# EAGLE board msi0010_new (EAGLE 6.1), part 1 of 2
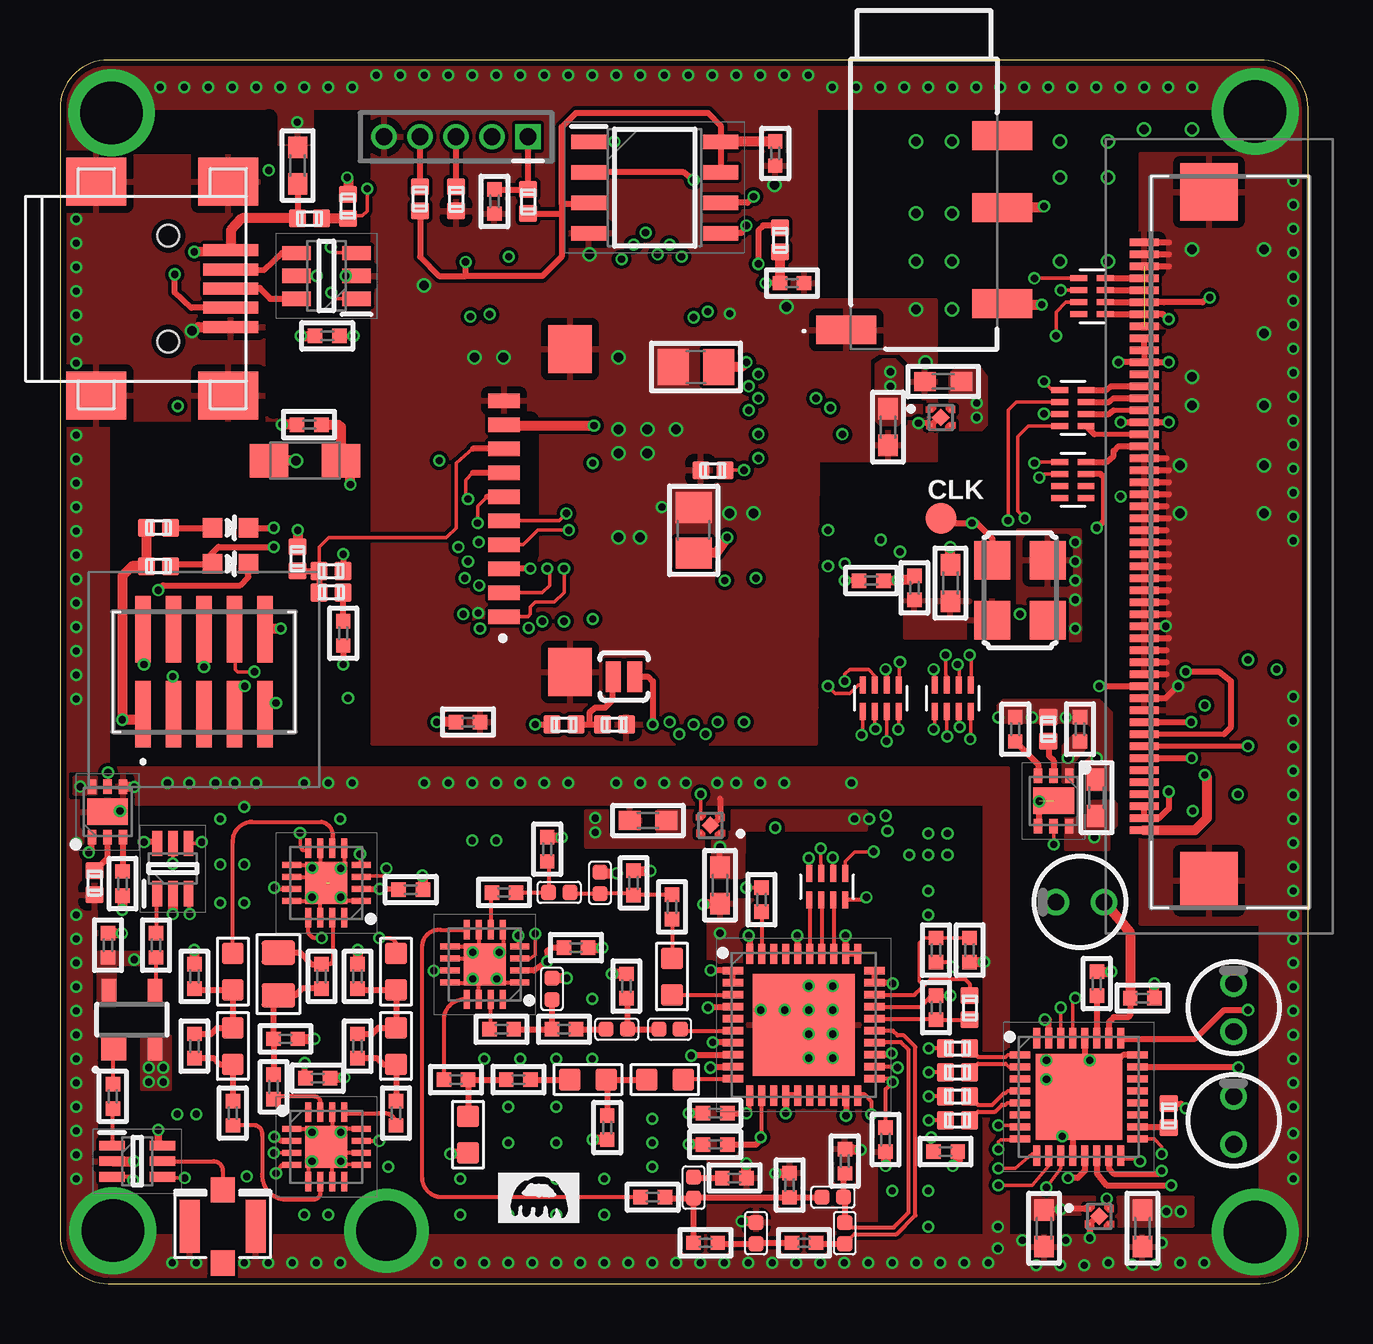
[diagram p3: board, top side]
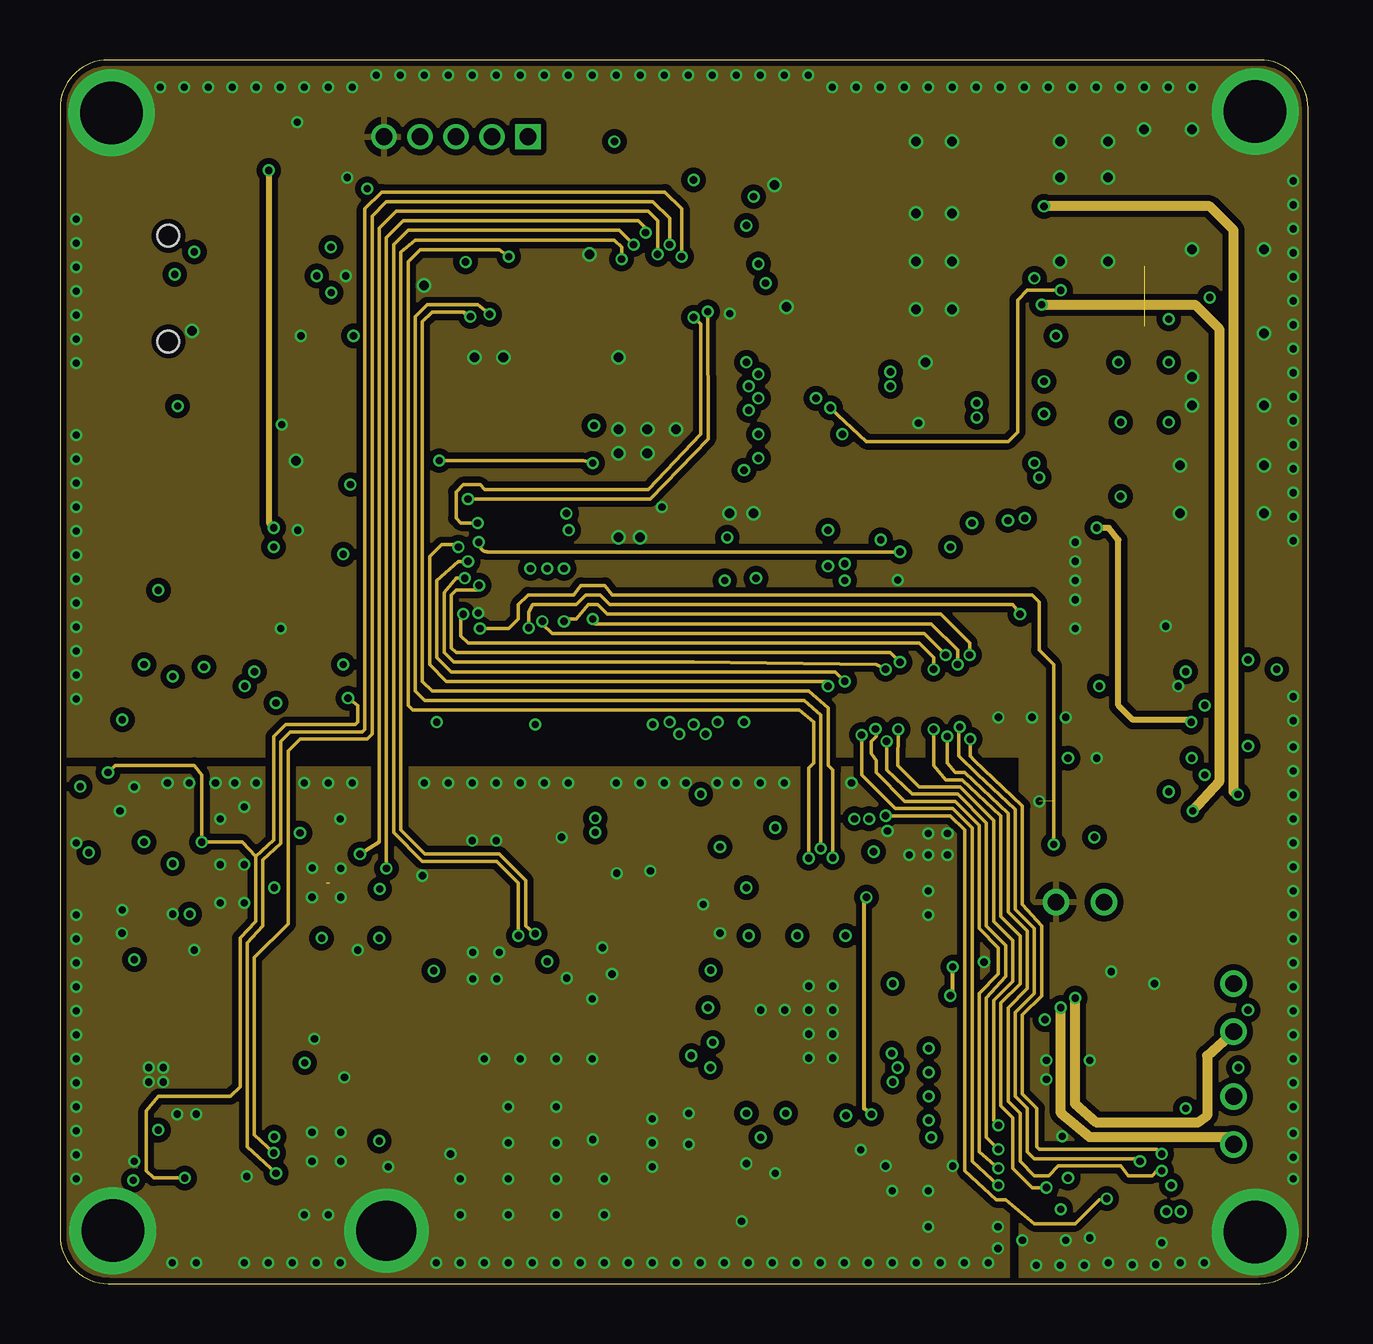
[diagram p4: board, inner layer Route2]
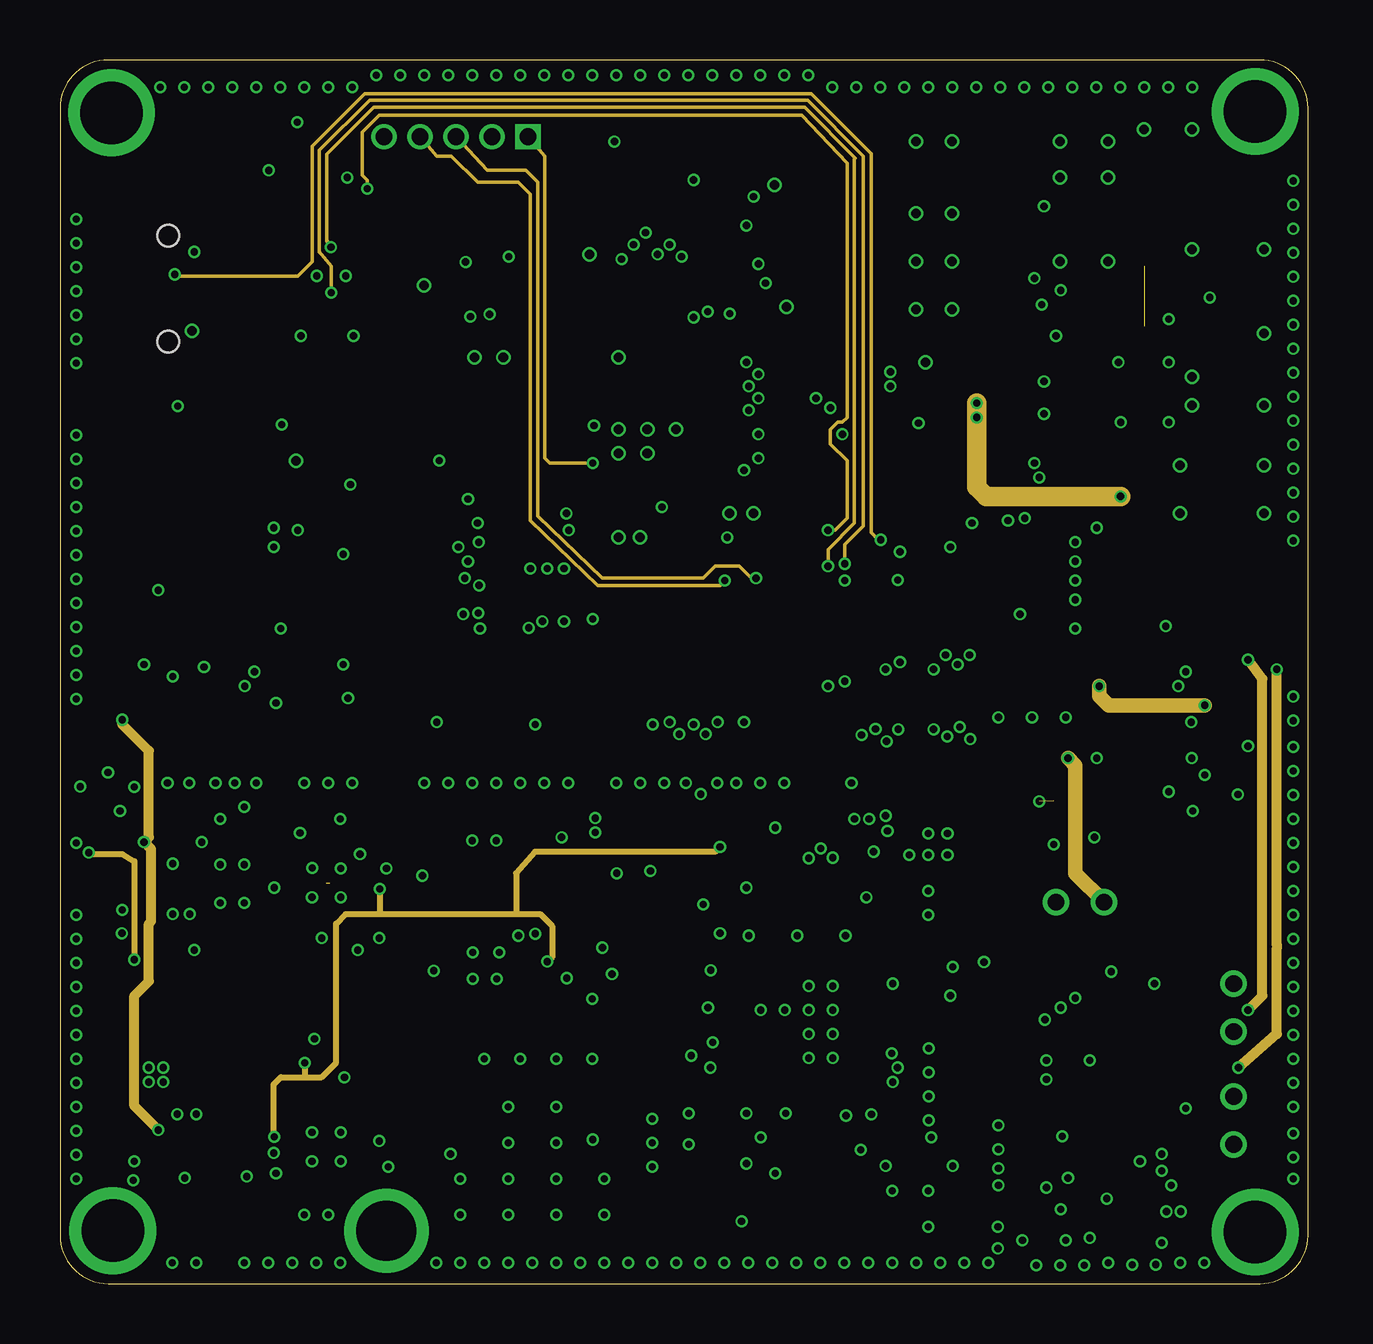
[diagram p5: board, inner layer Route3]
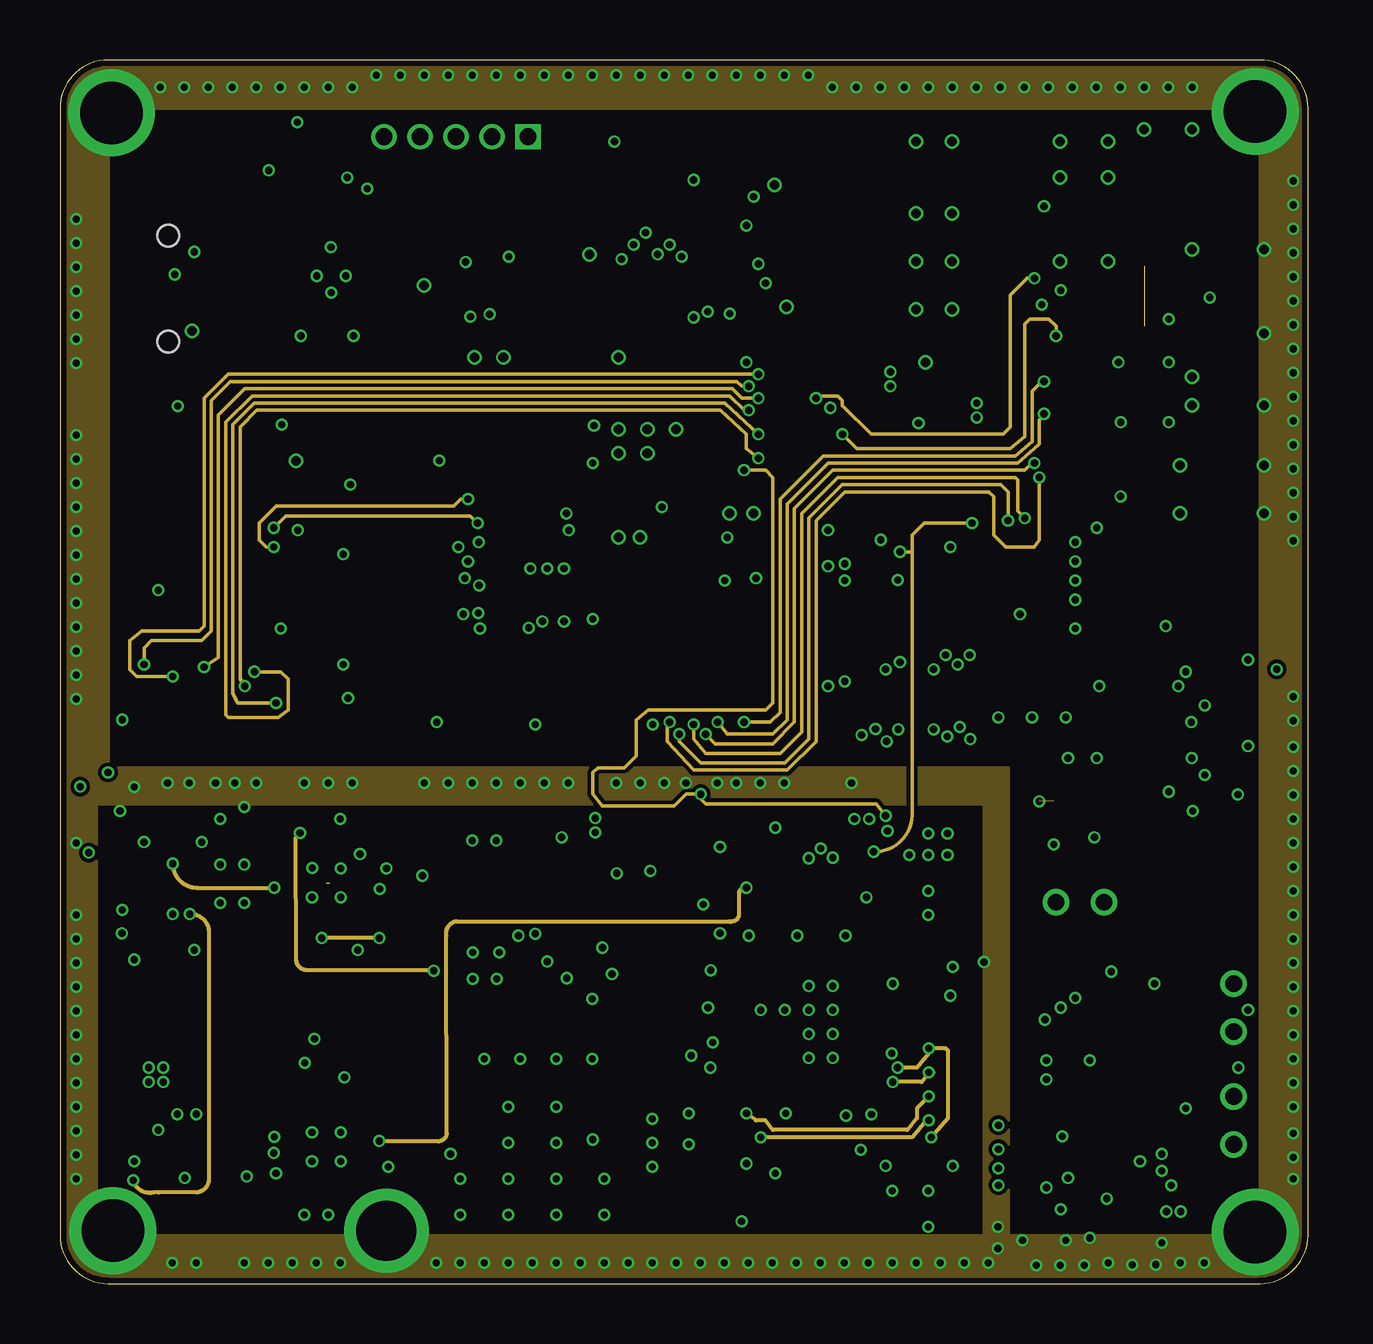
[diagram p6: board, inner layer Route14]
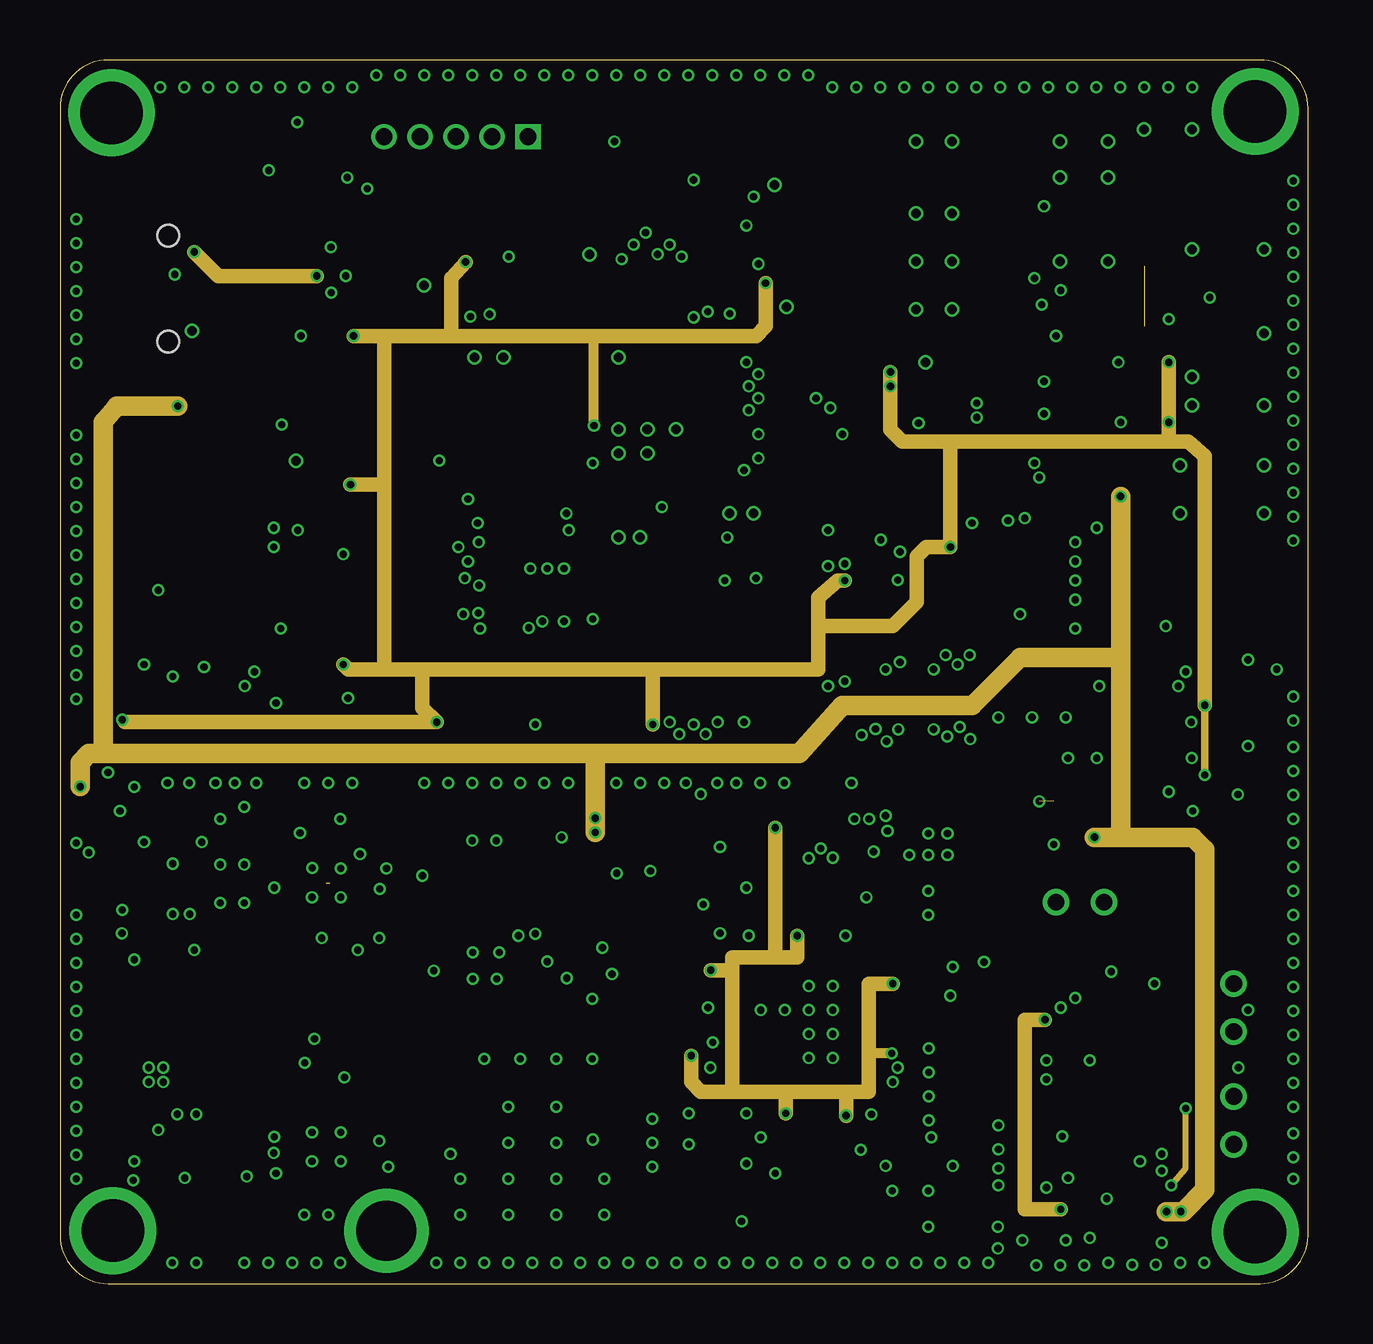
[diagram p7: board, inner layer Route15]
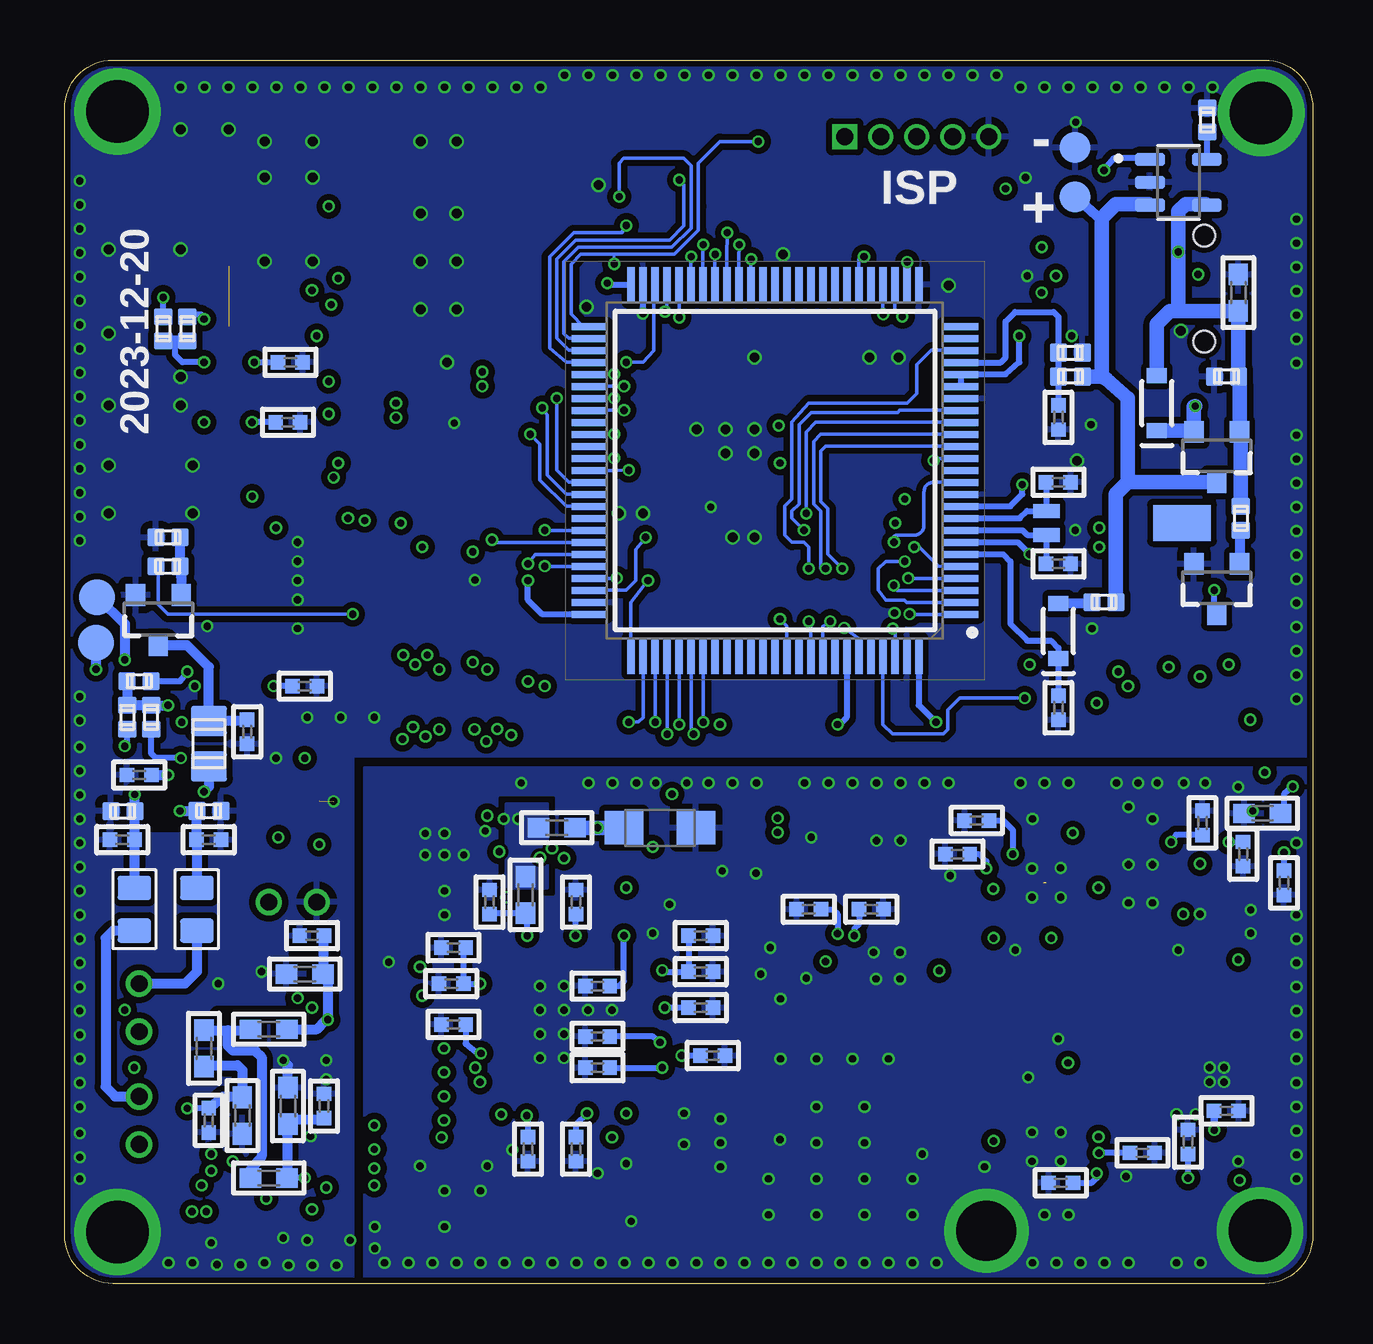
[diagram p8: board, bottom side, seen from below]

Size 52 x 51 mm. Coordinates in mm from the lower left corner, seen from the top.
Outline: 0,2 arc90 2,0 50,0 arc90 52,2 52,49 arc90 50,51 2,51 arc90 0,49 0,2
Copper layers (1*2*3*14*15*16): Top 0.035mm / dielectric 5mil / Route2 0.035mm / dielectric 0.5mm / Route3 0.035mm / dielectric 0.2mm / Route14 0.035mm / dielectric 0.5mm / Route15 0.035mm / dielectric 5mil / Bottom 0.035mm
Design rules: minimum track width 4.5mil, minimum drill 10mil, track to track 5mil, track to pad 5mil, pad to pad 5mil, via to via 5mil, smd to smd 1mil, copper to edge 10mil, drill to drill 8mil, minimum pad ring 6mil, minimum via ring 4mil, stop-mask expansion 4mil, vias tented up to drill 25mil, thermal gap 12mil
Net classes: 0 default: width 0.3 mm; 1 USB: width 0.406 mm; 2 gnd: width 0.254 mm, drill 0.584 mm, clearance 0.203 mm
tRestrict: 9 lines
bRestrict: 8 lines

## Footprints (pad centres in the part's own frame; a part is rotated, then mirrored left to right if it is on the bottom)
U.FL = smd 2.2 x 0.85: P$1 0,1.375; P$2 0,-1.375 | smd 1.05 x 1: P$3 1.525,0; P$4 -1.525,0
TP13R = smd 1.3 x 1.3: TP 0,0
_0402 = smd 0.6 x 0.6: 1 -0.508,0; 2 0.508,0
_0603 = smd 0.9 x 0.8: 1 -0.762,0; 2 0.762,0
SANYO-OSCON_A = drill 0.7 pad 1.1: + 1,0; - -1,0
SMC_A = smd 1.6 x 1.4: + -1.5,0; - 1.5,0
0805_NOTHERMALS = smd 1.3 x 1.5: 1 -0.95,0; 2 0.95,0
SOD-323 = smd 0.63 x 0.83: A 1.15,0; C -1.15,0
LED-0603 = smd 0.8 x 0.8: A 0,-0.75; C 0,0.75
SOT127P602X173-8N = smd 1.45 x 0.6: 1 -2.75,1.905; 2 -2.75,0.635; 3 -2.75,-0.635; 4 -2.75,-1.905; 5 2.75,-1.905; 6 2.75,-0.635; 7 2.75,0.635; 8 2.75,1.905
SOT95P280X145-6N = smd 1.2 x 0.6: 1 -1.25,0.95; 2 -1.25,0; 3 -1.25,-0.95; 4 1.25,-0.95; 5 1.25,0; 6 1.25,0.95
SON65P200X200X80-7N = smd 0.6 x 0.35: 1 -1.05,0.65; 2 -1.05,0; 3 -1.05,-0.65; 4 1.05,-0.65; 5 1.05,0; 6 1.05,0.65 | smd 1.1 x 1.7: 7 0,0
VREG_NCP170AMX285TCG = smd 0.1 x 0.1: 1 -0.405,0.325; 2 -0.405,-0.325; 3 0.405,-0.325; 4 0.405,0.325 | smd 0.52 x 0.52 rotated 45: 5 0,0
QFN50P500X500X80-33N = smd 0.85 x 0.3: 1 -2.45,1.75; 2 -2.45,1.25; 3 -2.45,0.75; 4 -2.45,0.25; 5 -2.45,-0.25; 6 -2.45,-0.75; 7 -2.45,-1.25; 8 -2.45,-1.75; 17 2.45,-1.75; 18 2.45,-1.25; 19 2.45,-0.75; 20 2.45,-0.25; 21 2.45,0.25; 22 2.45,0.75; 23 2.45,1.25; 24 2.45,1.75 | smd 0.3 x 0.85: 9 -1.75,-2.45; 10 -1.25,-2.45; 11 -0.75,-2.45; 12 -0.25,-2.45; 13 0.25,-2.45; 14 0.75,-2.45; 15 1.25,-2.45; 16 1.75,-2.45; 25 1.75,2.45; 26 1.25,2.45; 27 0.75,2.45; 28 0.25,2.45; 29 -0.25,2.45; 30 -0.75,2.45; 31 -1.25,2.45; 32 -1.75,2.45 | smd 3.6 x 3.6: 33 0,0
QFP50P1600X1600X160-100N = smd 1.475 x 0.3: 1 -7.738,6; 2 -7.738,5.5; 3 -7.738,5; 4 -7.738,4.5; 5 -7.738,4; 6 -7.738,3.5; 7 -7.738,3; 8 -7.738,2.5; 9 -7.738,2; 10 -7.738,1.5; 11 -7.738,1; 12 -7.738,0.5; 13 -7.738,0; 14 -7.738,-0.5; 15 -7.738,-1; 16 -7.738,-1.5; 17 -7.738,-2; 18 -7.738,-2.5; 19 -7.738,-3; 20 -7.738,-3.5; 21 -7.738,-4; 22 -7.738,-4.5; 23 -7.738,-5; 24 -7.738,-5.5; 25 -7.738,-6; 51 7.738,-6; 52 7.738,-5.5; 53 7.738,-5; 54 7.738,-4.5; 55 7.738,-4; 56 7.738,-3.5; 57 7.738,-3; 58 7.738,-2.5; 59 7.738,-2; 60 7.738,-1.5; 61 7.738,-1; 62 7.738,-0.5; 63 7.738,0; 64 7.738,0.5; 65 7.738,1; 66 7.738,1.5; 67 7.738,2; 68 7.738,2.5; 69 7.738,3; 70 7.738,3.5; 71 7.738,4; 72 7.738,4.5; 73 7.738,5; 74 7.738,5.5; 75 7.738,6 | smd 0.3 x 1.475: 26 -6,-7.738; 27 -5.5,-7.738; 28 -5,-7.738; 29 -4.5,-7.738; 30 -4,-7.738; 31 -3.5,-7.738; 32 -3,-7.738; 33 -2.5,-7.738; 34 -2,-7.738; 35 -1.5,-7.738; 36 -1,-7.738; 37 -0.5,-7.738; 38 0,-7.738; 39 0.5,-7.738; 40 1,-7.738; 41 1.5,-7.738; 42 2,-7.738; 43 2.5,-7.738; 44 3,-7.738; 45 3.5,-7.738; 46 4,-7.738; 47 4.5,-7.738; 48 5,-7.738; 49 5.5,-7.738; 50 6,-7.738; 76 6,7.738; 77 5.5,7.738; 78 5,7.738; 79 4.5,7.738; 80 4,7.738; 81 3.5,7.738; 82 3,7.738; 83 2.5,7.738; 84 2,7.738; 85 1.5,7.738; 86 1,7.738; 87 0.5,7.738; 88 0,7.738; 89 -0.5,7.738; 90 -1,7.738; 91 -1.5,7.738; 92 -2,7.738; 93 -2.5,7.738; 94 -3,7.738; 95 -3.5,7.738; 96 -4,7.738; 97 -4.5,7.738; 98 -5,7.738; 99 -5.5,7.738; 100 -6,7.738
QFN50P600X600X90-41N = smd 0.85 x 0.3: 1 -2.95,2.25; 2 -2.95,1.75; 3 -2.95,1.25; 4 -2.95,0.75; 5 -2.95,0.25; 6 -2.95,-0.25; 7 -2.95,-0.75; 8 -2.95,-1.25; 9 -2.95,-1.75; 10 -2.95,-2.25; 21 2.95,-2.25; 22 2.95,-1.75; 23 2.95,-1.25; 24 2.95,-0.75; 25 2.95,-0.25; 26 2.95,0.25; 27 2.95,0.75; 28 2.95,1.25; 29 2.95,1.75; 30 2.95,2.25 | smd 0.3 x 0.85: 11 -2.25,-2.95; 12 -1.75,-2.95; 13 -1.25,-2.95; 14 -0.75,-2.95; 15 -0.25,-2.95; 16 0.25,-2.95; 17 0.75,-2.95; 18 1.25,-2.95; 19 1.75,-2.95; 20 2.25,-2.95; 31 2.25,2.95; 32 1.75,2.95; 33 1.25,2.95; 34 0.75,2.95; 35 0.25,2.95; 36 -0.25,2.95; 37 -0.75,2.95; 38 -1.25,2.95; 39 -1.75,2.95; 40 -2.25,2.95 | smd 4.25 x 4.25: 41 0,0
4-SOT143 = smd 1.1 x 1.05: 1 -1.15,0.76 | smd 1.1 x 0.6: 2 -1.15,-0.96; 3 1.15,-0.96; 4 1.15,0.96
SOT65P210X110-6N = smd 1.05 x 0.4: 1 -1.05,0.65; 2 -1.05,0; 3 -1.05,-0.65; 4 1.05,-0.65; 5 1.05,0; 6 1.05,0.65
QFN50P300X300X80-17N = smd 0.8 x 0.25: 1 -1.45,0.75; 2 -1.45,0.25; 3 -1.45,-0.25; 4 -1.45,-0.75; 9 1.45,-0.75; 10 1.45,-0.25; 11 1.45,0.25; 12 1.45,0.75 | smd 0.25 x 0.8: 5 -0.75,-1.45; 6 -0.25,-1.45; 7 0.25,-1.45; 8 0.75,-1.45; 13 0.75,1.45; 14 0.25,1.45; 15 -0.25,1.45; 16 -0.75,1.45 | smd 1.75 x 1.75: 17 0,0
SOT95P280X100-5N = smd 1.24 x 0.55: 1 -1.185,0.95; 2 -1.185,0; 3 -1.185,-0.95; 4 1.185,-0.95; 5 1.185,0.95
3220-10-0300-00-TR_322010030000TR = smd 0.65 x 2.77: 1 -2.54,-1.765; 2 -2.54,1.765; 3 -1.27,-1.765; 4 -1.27,1.765; 5 0,-1.765; 6 0,1.765; 7 1.27,-1.765; 8 1.27,1.765; 9 2.54,-1.765; 10 2.54,1.765
62684502100ALF = smd 0.3 x 1.2: 1 -12,3.425; 2 -11.5,3.425; 3 -11,3.425; 4 -10.5,3.425; 5 -10,3.425; 6 -9.5,3.425; 7 -9,3.425; 8 -8.5,3.425; 9 -8,3.425; 10 -7.5,3.425; 11 -7,3.425; 12 -6.5,3.425; 13 -6,3.425; 14 -5.5,3.425; 15 -5,3.425; 16 -4.5,3.425; 17 -4,3.425; 18 -3.5,3.425; 19 -3,3.425; 20 -2.5,3.425; 21 -2,3.425; 22 -1.5,3.425; 23 -1,3.425; 24 -0.5,3.425; 25 0,3.425; 26 0.5,3.425; 27 1,3.425; 28 1.5,3.425; 29 2,3.425; 30 2.5,3.425; 31 3,3.425; 32 3.5,3.425; 33 4,3.425; 34 4.5,3.425; 35 5,3.425; 36 5.5,3.425; 37 6,3.425; 38 6.5,3.425; 39 7,3.425; 40 7.5,3.425; 41 8,3.425; 42 8.5,3.425; 43 9,3.425; 44 9.5,3.425; 45 10,3.425; 46 10.5,3.425; 47 11,3.425; 48 11.5,3.425; 49 12,3.425; 50 12.5,3.425 | smd 2.4 x 2.4: 51 -14.1,0.725; 52 14.6,0.725
PRT12639 = smd 1.2 x 2.5: 1 6.25,-3.25; 2 5.15,3.25; 3 1.15,3.25; 4 -1.85,3.25
686120148922_686120148922 = smd 0.6 x 1.3: 1 -9.5,2.9; 2 -8.5,2.9; 3 -7.5,2.9; 4 -6.5,2.9; 5 -5.5,2.9; 6 -4.5,2.9; 7 -3.5,2.9; 8 -2.5,2.9; 9 -1.5,2.9; 10 -0.5,2.9 | smd 2 x 1.8: MP1 -11.8,0.15; MP2 1.64,0.15
L0805@1 = smd 1.016 x 1.397: 1 -0.889,0; 2 0.889,0
L0603@1 = smd 0.889 x 0.889: 1 -0.762,0; 2 0.762,0
L0402@1 = smd 0.635 x 0.635: 1 -0.445,0; 2 0.445,0
SPARKFUN-CONNECTORS_PIC-ICSP-MINI = drill 0.7 square: 1 -3,0 | drill 0.7: 2 -1.5,0; 3 0,0; 4 1.5,0; 5 3,0
ASF = smd 1.6 x 1.5: 1 -1.25,-1.15; 2 1.25,-1.15; 3 1.25,1.15; 4 -1.25,1.15
SOT23-3 = smd 0.8 x 0.9: 1 -0.95,-1; 2 0.95,-1; 3 0,1.1
SOT23-3@1 = smd 0.8 x 0.9: 1 -0.95,-1; 2 0.95,-1; 3 0,1.1
C0402 = smd 0.75 x 0.7: 1 0,0.5; 2 0,-0.5
R_MATRIX_4_0402 = smd 0.25 x 0.7: 1.1 -0.75,-0.55; 1.2 -0.75,0.55; 2.1 -0.25,-0.55; 2.2 -0.25,0.55; 3.1 0.25,-0.55; 3.2 0.25,0.55; 4.1 0.75,-0.55; 4.2 0.75,0.55
C0805 = smd 1.5 x 1.25: 1 0,0.95; 2 0,-0.95
SJ_2S-NO = smd 0.635 x 1.27: 1 -0.45,0; 2 0.45,0
TP15R = smd 1.5 x 1.5: TP 0,0
MINI-USB-B5 = smd 2.3 x 0.5: 1 8.55,6.6; 2 8.55,5.8; 3 8.55,5; 4 8.55,4.2; 5 8.55,3.4 | smd 2.5 x 2: M1 2.95,9.45; M2 8.45,9.45; M3 2.95,0.55; M4 8.45,0.55 | hole 0.9: 5.95,2.8; 5.95,7.2
CRYSTAL-32KHZ-MS3V = smd 0.6 x 1.1: P$1 -0.5,-2; P$2 0.5,-2 | smd 1.5 x 2.4: P$3 0,3.65

## Placement (x,y rotation side)
A1  U.FL  [U.FL]  6.78,2.38 90 top
BATT  TPSTP13R  [TP13R]  9.9,45.3 0 bottom
BATT1  TPSTP13R  [TP13R]  9.9,47.35 0 bottom
C1  100n  [_0402]  29.8,47.1 90 top
C2  100n  [_0402]  42.6,38.4 180 bottom
C3  1uF  [_0603]  9.9,46.6 90 top
C4  100n  [_0402]  1.2,16.7 270 bottom
C5  1uF  [_0603]  2.1,19.6 180 bottom
C6  100n  [_0402]  42.7,35.9 0 bottom
C7  1n  [_0402]  2.61,16.67 270 top
C8  1uF  [_0603]  36.8,37.6 180 top
C9  100n  [_0402]  11.8,27.1 90 top
C10  100n  [_0402]  35.6,29 90 top
C11  47n  [_0402]  49.61,18.5 180 bottom
C12  47n  [_0402]  46,18.5 180 bottom
C13  1uF  [_0603]  45.1,2.3 270 top
C14  100n  [_0402]  42,24.9 0 bottom
C15  100n  [_0402]  42.5,23.1 90 top
C16  1uF  [_0603]  43.19,20.25 90 top
C17  100n  [_0402]  44.4,23 90 bottom
C18  100n  [_0402]  48.9,21.2 0 bottom
C19  220uF  [SANYO-OSCON_A]  48.9,6.8 270 top
C20  220uF  [SANYO-OSCON_A]  48.9,11.5 270 top
C21  1n  [_0402]  39.8,23.1 90 top
C22  1uF  [_0603]  24.5,19.3 180 top
C23  1uF  [_0603]  34.5,35.7 90 top
C24  10uF  [_0402]  43.2,12.5 90 top
C25  1uF  [_0603]  41,2.3 90 top
C26  100n  [_0603]  42,12.9 0 bottom
C27  10uF  [_0402]  41.7,14.5 0 bottom
C28  220uF  [SANYO-OSCON_A]  42.5,15.9 0 top
C29  100n  [_0402]  45.1,11.9 180 top
C30  10uF  [SMC_A]  10.2,34.3 180 top
C31  100n  [_0402]  17,23.4 180 top
C32  100n  [_0402]  35.8,14 180 bottom
C33  1uF  [_0603]  27.5,16.6 90 top
C34  100n  [_0402]  29.8,12.4 180 bottom
C35  47uF  [SMC_A]  27.2,19 0 bottom
C36  100n  [_0402]  18.1,45.1 270 top
C37  100n  [_0402]  11.14,39.5 0 top
C38  2.2uF  [0805_NOTHERMALS]  26.4,31.4 90 top
C39  100n  [_0402]  34.3,15.9 90 bottom
C40  10n  [_0402]  37.9,13.9 270 top
C41  1n  [_0402]  30.7,5.6 270 bottom
C42  100n  [_0402]  25.5,11.5 180 bottom
C43  1n  [_0402]  32.7,5.6 90 bottom
C44  6n8  [_0402]  36.5,13.9 90 top
C45  6n8  [_0402]  36.5,11.5 90 top
C46  100n  [_0402]  35.9,12.5 180 bottom
C47  100n  [_0402]  25.5,14.5 0 bottom
C48  10  [_0402]  10.6,30 180 bottom
C49  10  [_0402]  10.6,33.4 180 bottom
C50  100n  [_0402]  25,9.5 0 bottom
C51  100n  [_0402]  35.8,10.8 180 bottom
C52  100n  [_0402]  33.8,29.3 180 top
C53  100n  [_0402]  41.2,7.4 90 bottom
C54  10uF  [_0603]  42.7,7.4 90 bottom
C55  10uF  [_0402]  46,6.8 270 bottom
C56  100n  [_0603]  44.6,7 270 bottom
C57  100n  [_0402]  29.8,10.3 180 bottom
C58  100n  [_0402]  29.8,9 180 bottom
C59  10n  [_0402]  36.9,5.5 180 top
C60  10n  [_0402]  34.4,6 270 top
C61  10uF  [_0402]  10.6,24 90 bottom
C62  100n  [_0402]  25.5,13 180 bottom
C63  100n  [_0402]  30.7,15.9 270 bottom
C64  10n  [_0402]  27.3,5.8 180 top
C65  10n  [_0402]  27.3,7.1 180 top
C66  2.2uF  [0805_NOTHERMALS]  26.5,38.2 180 top
C67  100n  [_0402]  10.38,35.8 0 top
C68  100n  [_0402]  30.5,41.7 0 top
C69  100n  [_0402]  2,14.1 90 top
C70  100n  [_0402]  4.6,19.2 90 bottom
C71  100n  [_0402]  4,14.1 270 top
C72  100n  [_0402]  2.2,7.8 270 top
C73  100n  [_0402]  5.2,5.9 90 bottom
C74  39  [_0402]  19.1,8.5 180 top
C75  10n  [_0402]  16.5,8.5 180 top
C76  1.8  [_0402]  22.8,6.5 90 top
C77  2.2  [_0402]  31,1.7 180 top
C78  1.8  [_0402]  26.9,1.7 180 top
C79  4.7  [_0402]  24.7,3.6 180 top
C80  4.7  [_0402]  21,10.6 180 top
C81  10n  [_0402]  18.4,10.6 180 top
C82  2.7  [_0402]  23.6,12.4 270 top
C83  27  [_0402]  28.1,4.4 180 top
C84  1.8  [_0402]  32.7,5.1 90 top
C85  27  [_0402]  30.4,4.1 90 top
C86  10  [_0402]  25.5,15.7 90 top
C87  10  [_0402]  18.5,16.3 0 top
C88  1.5  [_0402]  20.3,18.1 270 top
C89  22  [_0402]  23.9,16.7 270 top
C90  3.3  [_0402]  10.9,12.8 270 top
C91  100n  [_0402]  8.9,8.2 270 top
C92  120  [_0402]  9.4,10.2 180 top
C93  3.9  [_0402]  12.4,9.9 270 top
C94  39  [_0402]  14,7.1 270 top
C95  39  [_0402]  12.4,12.8 270 top
C96  100n  [_0402]  29.23,16 90 top
C97  100n  [_0402]  14.61,16.42 0 top
C98  100n  [_0402]  10.74,8.56 0 top
C99  100n  [_0402]  21.5,14 0 top
C100  100n  [_0402]  7.1,5.45 180 bottom
C101  100n  [_0402]  21,15.6 0 bottom
C102  100n  [_0402]  10.5,4.2 0 bottom
C103  100n  [_0402]  14.8,17.9 0 bottom
C104  2.7  [_0402]  5.6,9.9 270 top
C105  180  [_0402]  7.2,7.1 270 top
C106  100n  [_0402]  18.4,15.6 0 bottom
C107  82  [_0402]  5.6,12.8 270 top
C108  100n  [_0402]  14,19.3 180 bottom
C109  1uF  [_0603]  3.1,41.3 270 bottom
C110  100n  [_0402]  10.6,36.1 90 bottom
C111  100n  [_0402]  3.6,7.2 0 bottom
C112  100n  [_0402]  2.9,17.9 270 bottom
CLK  TPSTP13R  [TP13R]  36.7,31.9 0 top
D1  1A/40V/500mV  [SOD-323]  10.6,27.2 90 bottom
D2  1 led  [LED-0603]  7.1,31.5 270 top
D3  1 led  [LED-0603]  7.1,30 270 top
D4  1A/40V/500mV  [SOD-323]  6.5,36.7 90 bottom
FB1  FERITTE  [_0603]  37.1,29.2 90 top
FB2  FERITTE  [_0603]  43.5,10.6 0 bottom
FB3  FERITTE  [_0603]  32.8,16.2 270 bottom
FB4  FERITTE  [_0603]  31.5,19 0 bottom
FB5  FERITTE  [_0603]  43.5,4.4 0 bottom
FB6  FERITTE  [_0603]  46.2,9.8 90 bottom
IC1  FM25W256-GTR  [SOT127P602X173-8N]  24.78,45.68 0 top
IC2  USBLC6-2SC6  [SOT95P280X145-6N]  11.1,42 180 top
IC3  TPS22810DRVT  [SON65P200X200X80-7N]  1.98,19.66 90 top
IC4  NCV8161AMX330TBG  [VREG_NCP170AMX285TCG]  36.7,36.1 0 top
IC5  TPS22810DRVT  [SON65P200X200X80-7N]  41.4,20.12 270 top
IC6  NCV8161AMX330TBG  [VREG_NCP170AMX285TCG]  43.3,2.8 0 top
IC7  NCV8161AMX330TBG  [VREG_NCP170AMX285TCG]  27.1,19.1 180 top
IC8  NAU8822LYG  [QFN50P500X500X80-33N]  42.45,7.78 0 top
IC9  STM32H743VIT6  [QFP50P1600X1600X160-100N]  22.41,33.89 180 bottom
IC10  MSI001  [QFN50P600X600X90-41N]  30.99,10.79 0 top
IC11  MAX2650EUS+T  [4-SOT143]  3,11 90 top
IC12  PE4259  [SOT65P210X110-6N]  3.22,5.1 0 top
IC13  PE4259  [SOT65P210X110-6N]  4.7,17.3 90 top
IC14  PE42641MLBD-Z  [QFN50P300X300X80-17N]  17.7,13.3 180 top
IC15  PE42641MLBD-Z  [QFN50P300X300X80-17N]  11.1,16.7 180 top
IC16  PE42641MLBD-Z  [QFN50P300X300X80-17N]  11.1,5.7 0 top
IC17  LTC4054LES5-4.2  [SOT95P280X100-5N]  5.6,45.9 0 bottom
J1  J20  [3220-10-0300-00-TR_322010030000TR]  6,25.5 0 top
J2  62684-502100ALF  [62684502100ALF]  48.6,30.9 90 top
J3  PRT-12639  [PRT12639]  36,46 270 top
J4  J10  [686120148922_686120148922]  21.4,37.3 90 top
L1  10uH  [L0805@1]  49.1,15.6 90 bottom
L2  10uH  [L0805@1]  46.5,15.6 90 bottom
L3  68nH  [L0603@1]  25.2,8.5 180 top
L4  100nH  [L0603@1]  22,8.5 180 top
L5  270nH  [L0603@1]  17,6.2 90 top
L6  6.8nH  [L0402@1]  29,2.1 90 top
L7  22nH  [L0402@1]  26.4,4 90 top
L8  8.2nH  [L0402@1]  32.7,2.1 90 top
L9  15nH  [L0402@1]  25.4,10.6 180 top
L10  27nH  [L0402@1]  23.2,10.6 180 top
L11  6.8nH  [L0402@1]  32.2,3.6 0 top
L12  47nH  [L0402@1]  20.5,12.28 270 top
L13  82nH  [L0603@1]  25.5,12.8 90 top
L14  100nH  [L0402@1]  20.8,16.3 0 top
L15  1uF  [L0805@1]  9.1,12.9 90 top
L16  39nH  [L0402@1]  22.5,16.7 270 top
L17  330nF  [L0603@1]  14,9.9 90 top
L18  220nH  [L0603@1]  14,13 90 top
L19  470nH  [L0603@1]  7.2,9.9 90 top
L20  330nH  [L0603@1]  7.2,13 90 top
PR  ISP  [SPARKFUN-CONNECTORS_PIC-ICSP-MINI]  16.5,47.8 180 top
Q1  ASFL  [ASF]  40,28.9 90 top
Q2  BSS138  [SOT23-3]  48.1,27.7 180 bottom
Q3  1.1A/60V/600mΩ  [SOT23-3@1]  4,34.5 180 bottom
Q4  BSS138  [SOT23-3]  4,29 180 bottom
R1  4.7k  [C0402]  10.4,44.4 90 top
R2  10k  [C0402]  12,44.9 180 top
R3  10k  [C0402]  15,45.2 180 top
R4  10k  [C0402]  16.5,45.2 0 top
R5  22  [R_MATRIX_4_0402]  43,41.15 270 top
R6  22  [R_MATRIX_4_0402]  42.2,33.5 270 top
R7  22  [R_MATRIX_4_0402]  42.2,36.5 270 top
R8  470  [C0402]  1.44,16.7 0 top
R9  100  [C0402]  11.3,28.8 270 top
R10  330  [C0402]  11.3,29.7 90 top
R11  47k  [C0402]  49.58,19.69 90 bottom
R12  47k  [C0402]  46,19.7 90 bottom
R13  220k  [C0402]  9.9,30.2 180 top
R14  4.7k  [C0402]  48.9,25.1 270 bottom
R15  4.7k  [C0402]  49.4,23.6 0 bottom
R16  4.7k  [C0402]  48.4,23.6 180 bottom
R17  10  [C0805]  46,22.5 0 bottom
R18  470  [C0402]  41.18,23.1 180 top
R19  150k  [C0402]  47.7,31.1 270 bottom
R20  4.7k  [C0402]  47.7,29.9 90 bottom
R21  10k  [C0402]  27.2,33.9 90 top
R22  470  [C0402]  21,23.3 90 top
R23  22  [R_MATRIX_4_0402]  31.96,16.54 180 top
R24  10k  [C0402]  23.1,23.3 90 top
R25  10k  [C0402]  19.5,45.1 0 top
R26  390  [C0402]  37.9,11.5 0 top
R27  22  [R_MATRIX_4_0402]  34.2,24.4 180 top
R28  47k  [C0402]  46.2,7 0 top
R29  470  [C0402]  37.4,9.8 90 top
R30  470  [C0402]  37.4,8.8 90 top
R31  470  [C0402]  37.4,6.8 90 top
R32  22  [R_MATRIX_4_0402]  37.2,24.4 0 top
R33  470  [C0402]  37.4,7.8 90 top
R34  100  [C0402]  8.7,28.4 270 bottom
R35  470  [C0402]  4.1,31.5 270 top
R36  1.65k  [C0402]  4.4,48.5 180 bottom
R37  470  [C0402]  4.1,29.9 270 top
R38  10k  [C0402]  3,31.9 0 bottom
R39  10k  [C0402]  3.6,37.8 270 bottom
R40  10k  [C0402]  10.1,37.8 270 bottom
R41  10k  [C0402]  10.1,38.8 90 bottom
R42  10k  [C0402]  30,43.5 0 top
R43  10k  [C0402]  47.9,39.8 0 bottom
R44  10k  [C0402]  46.9,39.8 0 bottom
S1  [SJ_2S-NO]  23.5,25.3 0 top
SP  TPSTP15R  [TP15R]  50.7,26.7 0 bottom
SP1  TPSTP15R  [TP15R]  50.65,28.61 0 bottom
USB  MINI-USB  [MINI-USB-B5]  -1.43,36.47 0 top
Y1  32KHz  [CRYSTAL-32KHZ-MS3V]  9.1,31.7 270 bottom